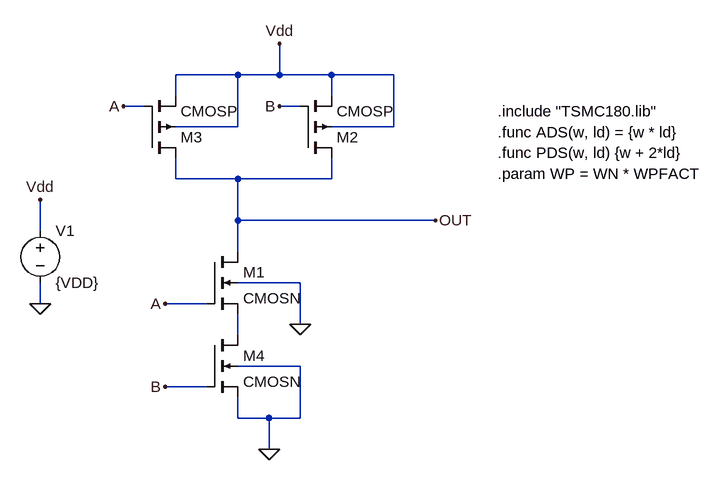
[diagram p0: schematic nand.asc]
nand.asc, the LTspice schematic file:
Version 4
SHEET 1 1180 680
WIRE -112 -16 -208 -16
WIRE -48 -16 -48 -64
WIRE -48 -16 -112 -16
WIRE 32 -16 -48 -16
WIRE 128 -16 32 -16
WIRE -208 16 -208 -16
WIRE 32 16 32 -16
WIRE -256 32 -288 32
WIRE -16 32 -48 32
WIRE -112 64 -112 -16
WIRE -112 64 -208 64
WIRE 128 64 128 -16
WIRE 128 64 32 64
WIRE -208 144 -208 112
WIRE -112 144 -208 144
WIRE 32 144 32 112
WIRE 32 144 -112 144
WIRE -112 208 -112 144
WIRE 192 208 -112 208
WIRE -416 224 -416 176
WIRE -112 256 -112 208
WIRE -16 304 -112 304
WIRE -416 336 -416 304
WIRE -160 336 -224 336
WIRE -16 368 -16 304
WIRE -112 384 -112 352
WIRE -16 432 -112 432
WIRE -160 464 -224 464
WIRE -112 512 -112 480
WIRE -64 512 -112 512
WIRE -16 512 -16 432
WIRE -16 512 -64 512
WIRE -64 560 -64 512
FLAG -416 176 Vdd
FLAG -416 336 0
FLAG -48 -64 Vdd
FLAG -288 32 A
FLAG -224 336 A
FLAG -48 32 B
FLAG -224 464 B
FLAG 192 208 OUT
FLAG -16 368 0
FLAG -64 560 0
SYMBOL nmos4 -160 256 R0
SYMATTR InstName M1
SYMATTR Value CMOSN
SYMATTR Value2 l={L} w={2*WN} ad={ADS(2*WN,LD)} as={ADS(2*WN,LD)} pd={PDS(2*WN,LD)} ps={PDS(2*WN,LD)}
SYMBOL pmos4 -16 112 M180
SYMATTR InstName M2
SYMATTR Value CMOSP
SYMATTR Value2 l={L} w={WP} ad={ADS(WP,LD)} as={ADS(WP,LD)} pd={PDS(WP,LD)} ps={PDS(WP,LD)}
SYMBOL voltage -416 208 R0
WINDOW 123 0 0 Left 0
WINDOW 39 0 0 Left 0
SYMATTR InstName V1
SYMATTR Value {VDD}
SYMBOL pmos4 -256 112 M180
SYMATTR InstName M3
SYMATTR Value CMOSP
SYMATTR Value2 l={L} w={WP} ad={ADS(WP,LD)} as={ADS(WP,LD)} pd={PDS(WP,LD)} ps={PDS(WP,LD)}
SYMBOL nmos4 -160 384 R0
SYMATTR InstName M4
SYMATTR Value CMOSN
SYMATTR Value2 l={L} w={2*WN} ad={ADS(2*WN,LD)} as={ADS(2*WN,LD)} pd={PDS(2*WN,LD)} ps={PDS(2*WN,LD)}
TEXT 288 136 Left 2 !.param WP = WN * WPFACT
TEXT 288 40 Left 2 !.include "TSMC180.lib"
TEXT 288 72 Left 2 !.func ADS(w, ld) = {w * ld}
TEXT 288 104 Left 2 !.func PDS(w, ld) {w + 2*ld}

The netlist it stands for:
* nand.asc
M1 OUT A N001 0 CMOSN l={L} w={2*WN} ad={ADS(2*WN,LD)} as={ADS(2*WN,LD)} pd={PDS(2*WN,LD)} ps={PDS(2*WN,LD)}
M2 OUT B Vdd Vdd CMOSP l={L} w={WP} ad={ADS(WP,LD)} as={ADS(WP,LD)} pd={PDS(WP,LD)} ps={PDS(WP,LD)}
V1 Vdd 0 {VDD}
M3 OUT A Vdd Vdd CMOSP l={L} w={WP} ad={ADS(WP,LD)} as={ADS(WP,LD)} pd={PDS(WP,LD)} ps={PDS(WP,LD)}
M4 N001 B 0 0 CMOSN l={L} w={2*WN} ad={ADS(2*WN,LD)} as={ADS(2*WN,LD)} pd={PDS(2*WN,LD)} ps={PDS(2*WN,LD)}
.model NMOS NMOS
.model PMOS PMOS
.lib standard.mos
.param WP = WN * WPFACT
.include "TSMC180.lib"
.func ADS(w, ld) = {w * ld}
.func PDS(w, ld) {w + 2*ld}
.backanno
.end